# EAGLE design NS_ARM_Control_07_17_2017_10pm (EAGLE 6.6.0)
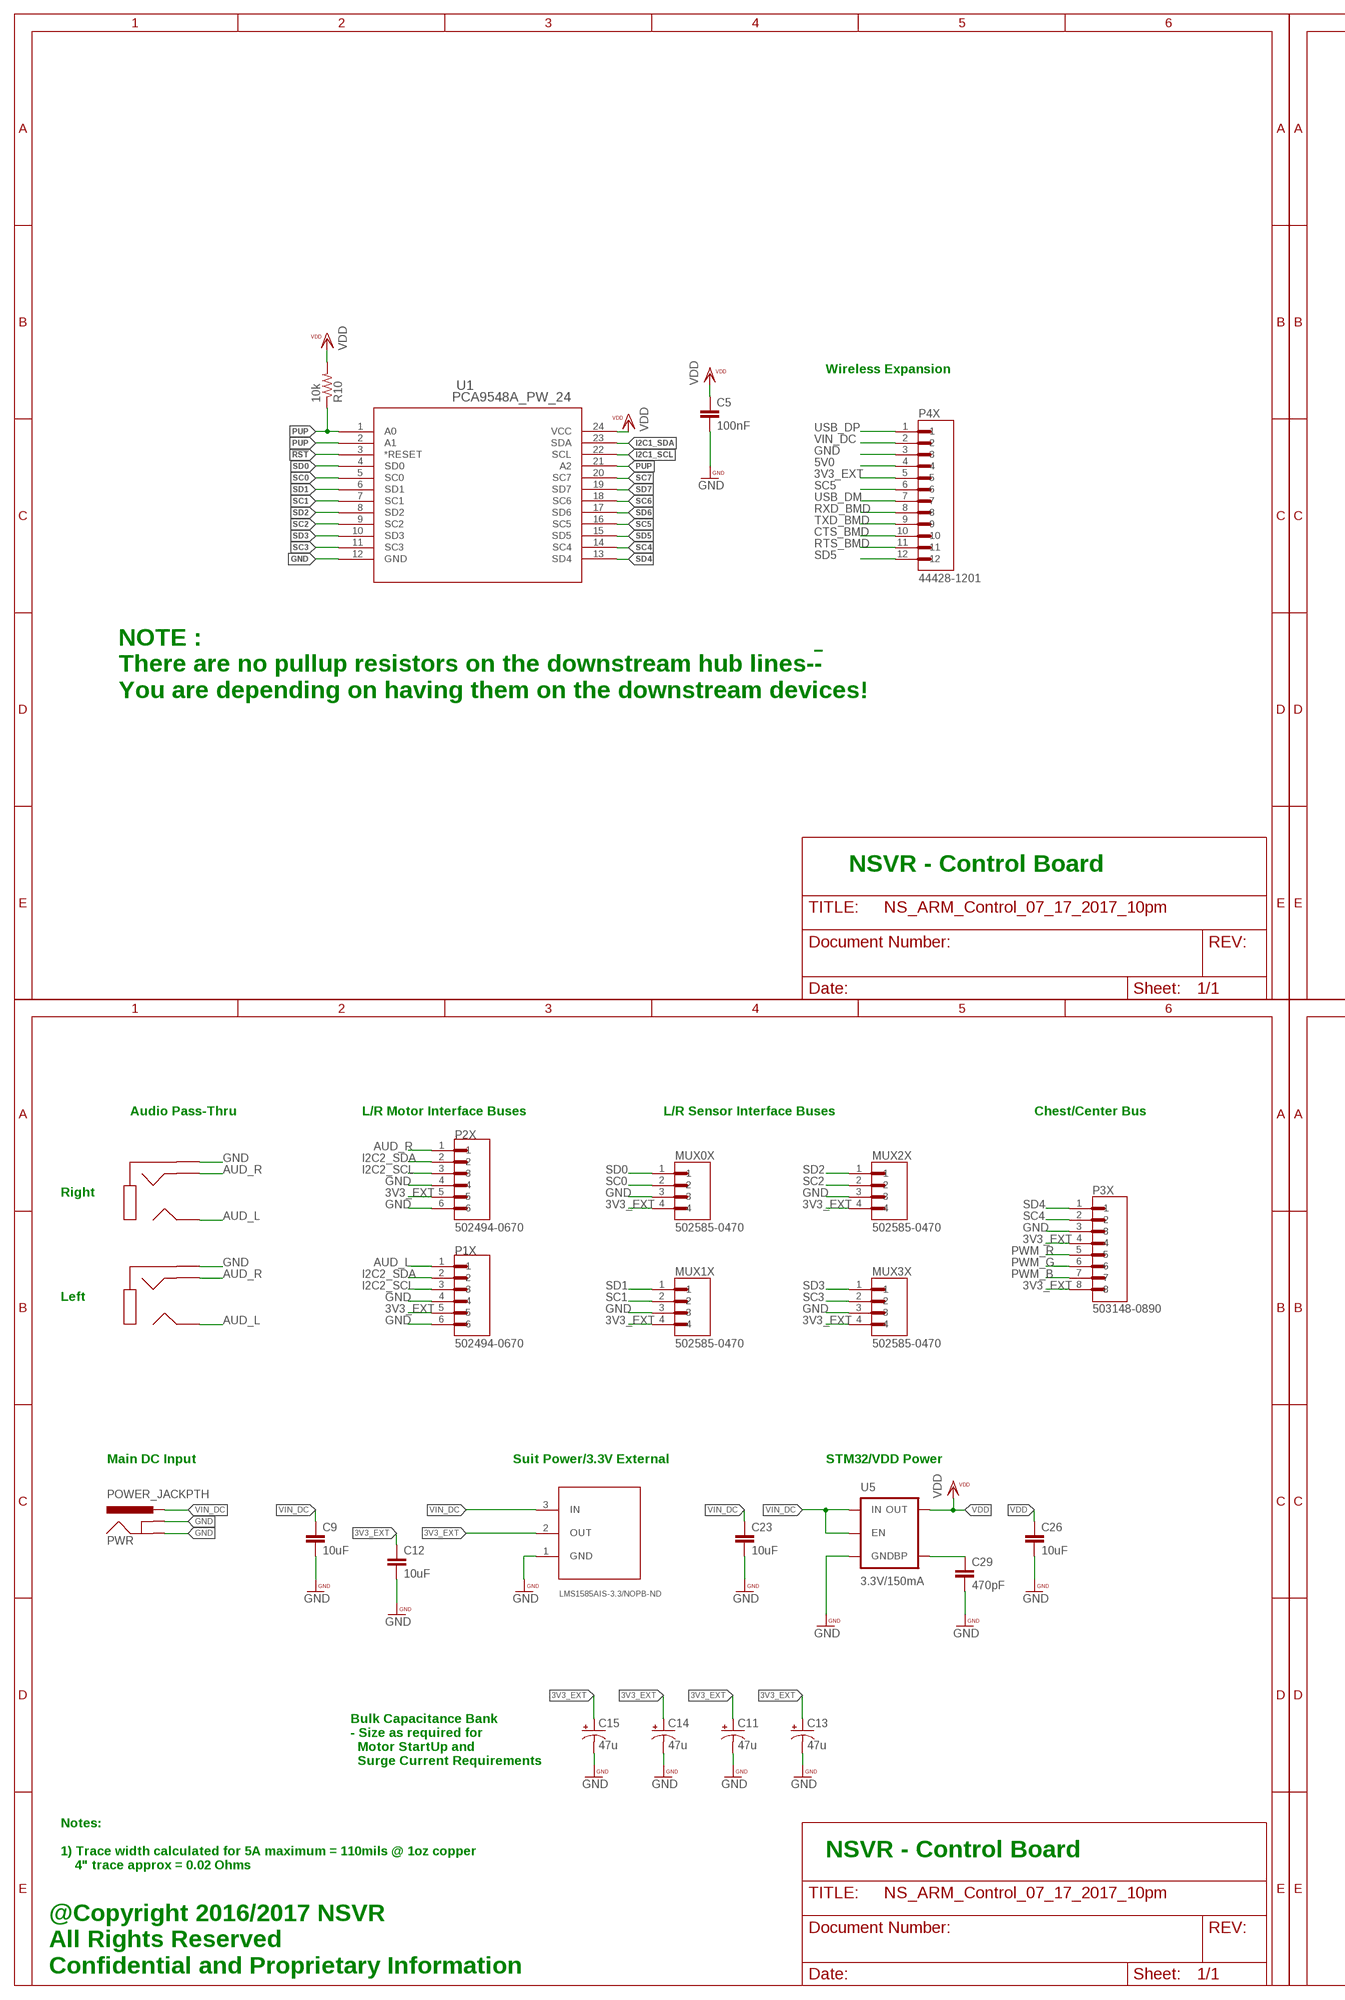
[diagram p0: schematic, sheet 1, part 1 of 2]
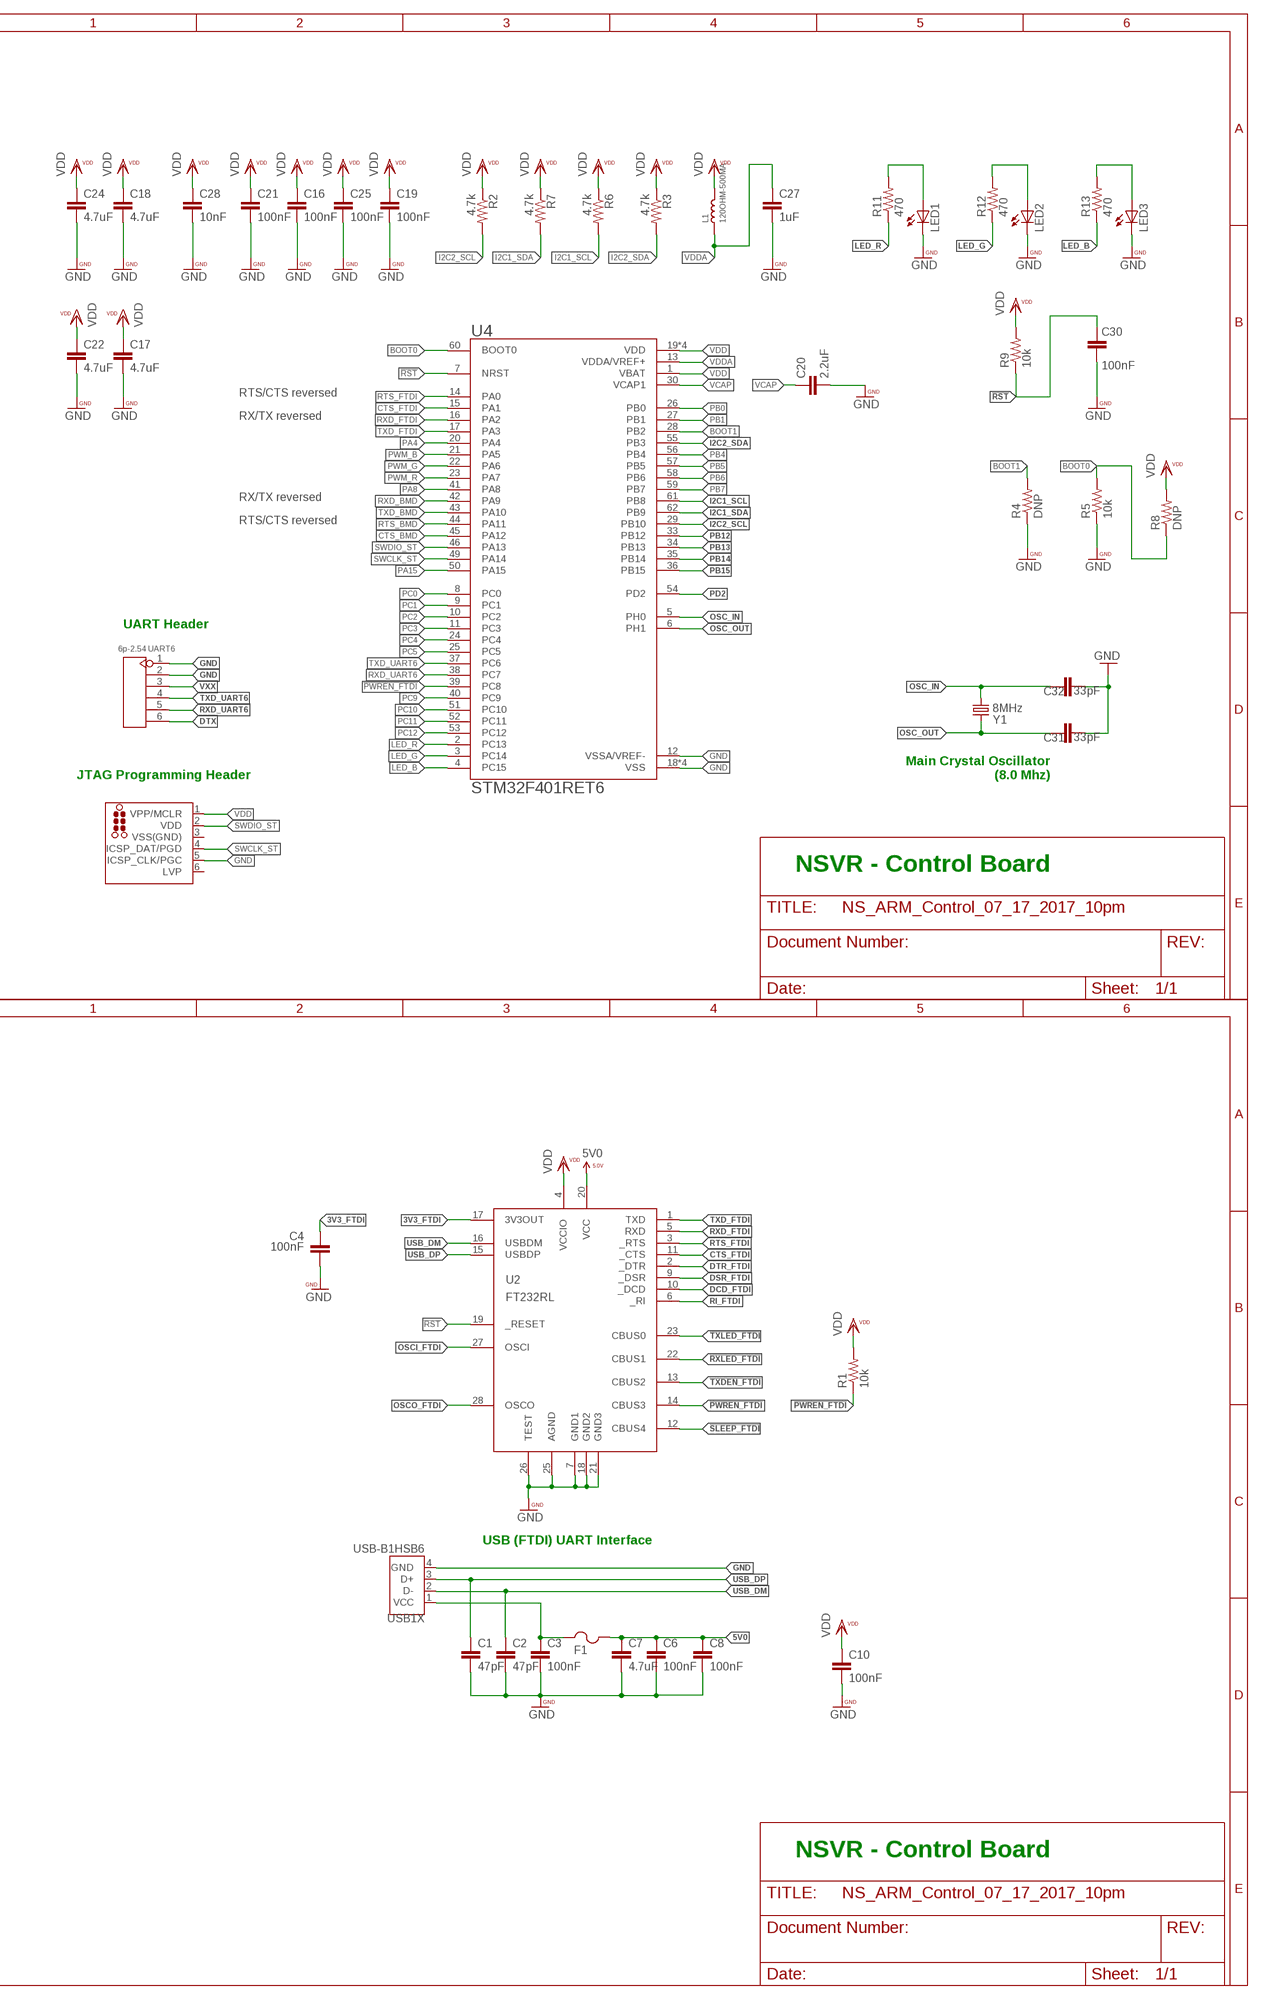
[diagram p1: schematic, sheet 1, part 2 of 2]

## Parts
C1  47pF  CAP0402-CAP  [0402-CAP]
C2  47pF  CAP0402-CAP  [0402-CAP]
C3  100nF  CAP0402-CAP  [0402-CAP]
C4  100nF  CAP0402-CAP  [0402-CAP]
C5  100nF  CAP0402-CAP  [0402-CAP]
C6  100nF  CAP0402-CAP  [0402-CAP]
C7  4.7uF  CAP0402-CAP  [0402-CAP]
C8  100nF  CAP0402-CAP  [0402-CAP]
C9  10uF  CAP0603-CAP  [0603-CAP]
C10  100nF  CAP0402-CAP  [0402-CAP]
C11  47u  CAP_POLD  [PANASONIC_D]
C12  10uF  CAP0603-CAP  [0603-CAP]
C13  47u  CAP_POLD  [PANASONIC_D]
C14  47u  CAP_POLD  [PANASONIC_D]
C15  47u  CAP_POLD  [PANASONIC_D]
C16  100nF  CAP0402-CAP  [0402-CAP]
C17  4.7uF  CAP0402-CAP  [0402-CAP]
C18  4.7uF  CAP0402-CAP  [0402-CAP]
C19  100nF  CAP0402-CAP  [0402-CAP]
C20  2.2uF  CAP0402-CAP  [0402-CAP]
C21  100nF  CAP0402-CAP  [0402-CAP]
C22  4.7uF  CAP0402-CAP  [0402-CAP]
C23  10uF  CAP0603-CAP  [0603-CAP]
C24  4.7uF  CAP0402-CAP  [0402-CAP]
C25  100nF  CAP0402-CAP  [0402-CAP]
C26  10uF  CAP0603-CAP  [0603-CAP]
C27  1uF  CAP0402-CAP  [0402-CAP]
C28  10nF  CAP0402-CAP  [0402-CAP]
C29  470pF  CAP0402-CAP  [0402-CAP]
C30  100nF  CAP0402-CAP  [0402-CAP]
C31  33pF  CAP0402-CAP  [0402-CAP]
C32  33pF  CAP0402-CAP  [0402-CAP]
F1  1206L050YR  [1206LSERIES]
J_ST  TC2030-MCP-NL  [TC2030-MCP-NL]
L1  120OHM-500MA  SMD-FERRITE-CHIP-120-OHM-500MA(0603)  [L0603]
LED1  LEDCHIP-LED0603  [CHIP-LED0603]
LED2  LEDCHIP-LED0603  [CHIP-LED0603]
LED3  LEDCHIP-LED0603  [CHIP-LED0603]
MUX0X  502585-0470  [MOLEX_502585-0470]
MUX1X  502585-0470  [MOLEX_502585-0470]
MUX2X  502585-0470  [MOLEX_502585-0470]
MUX3X  502585-0470  [MOLEX_502585-0470]
P1X  502494-0670  [MOLEX_502494-0670]
P2X  502494-0670  [MOLEX_502494-0670]
P3X  503148-0890  [MOLEX_503148-0890]
P4X  44428-1201  [MOLEX_44428-1201]
PJ1  SJ1-3513N  [SJ1-351XN]
PJ2  SJ1-3513N  [SJ1-351XN]
PWR  POWER_JACKPTH  [POWER_JACK_PTH]
R1  10k  RESISTOR0402-TYP  [EIA-0402]
R2  4.7k  RESISTOR0402-TYP  [EIA-0402]
R3  4.7k  RESISTOR0402-TYP  [EIA-0402]
R4  DNP  RESISTOR0402-TYP  [EIA-0402]
R5  10k  RESISTOR0402-TYP  [EIA-0402]
R6  4.7k  RESISTOR0402-TYP  [EIA-0402]
R7  4.7k  RESISTOR0402-TYP  [EIA-0402]
R8  DNP  RESISTOR0402-TYP  [EIA-0402]
R9  10k  RESISTOR0402-TYP  [EIA-0402]
R10  10k  RESISTOR0402-TYP  [EIA-0402]
R11  470  RESISTOR0402-TYP  [EIA-0402]
R12  470  RESISTOR0402-TYP  [EIA-0402]
R13  470  RESISTOR0402-TYP  [EIA-0402]
U1  PCA9548A_PW_24  [PW24]
U2  FT232RL  [SSOP28DB]
U3  LMS1585AIS-3.3/NOPB-ND  [TO254P1524X483-4N]
U4  STM32F401RET6  [QFP50P1200X1200X160-64N]
U5  3.3V/150mA  V_REG_MIC52053.3V  [SOT23-5]
UART6  6p-2.54  DIP-BLACK-FEMALE-HEADER-VERT(6P-2.54)  [H6-2.54]
USB1X  USB-B1HSB6  [OST_USB-B1HSB6]
Y1  8MHz  CRYSTAL5X3  [CRYSTAL-SMD-5X3]

## Nets
3V3_EXT: C11.+ C12.1 C13.+ C14.+ C15.+ MUX0X.4 MUX1X.4 MUX2X.4 MUX3X.4 P1X.5 P2X.5 P3X.4 P3X.8 P4X.5 U3.2(OUT)
3V3_FTDI: C4.1 U2.17(3V3OUT)
5V0: C6.1 C7.1 C8.1 F1.2 P4X.4 U2.20(VCC)
!PWREN_FTDI: R1.1 U2.14(CBUS3) U4.39(PC8)
!RST: C30.1 R9.1 U1.3(*RESET) U2.19(_RESET) U4.7(NRST)
!RXLED_FTDI: U2.22(CBUS1)
!SLEEP_FTDI: U2.12(CBUS4)
!TXDEN_FTDI: U2.13(CBUS2)
!TXLED_FTDI: U2.23(CBUS0)
AUD_L: P1X.1 PJ1.2 PJ2.2
AUD_R: P2X.1 PJ1.3 PJ2.3
BOOT0: R5.2 R8.1 U4.60(BOOT0)
BOOT1: R4.2 U4.28(PB2)
CTS_BMD: P4X.10 U4.45(PA12)
CTS_FTDI: U2.11(_CTS) U4.15(PA1)
DCD_FTDI: U2.10(_DCD)
DSR_FTDI: U2.9(_DSR)
DTR_FTDI: U2.2(_DTR)
DTX: UART6.6
GND: C1.2 C2.2 C3.2 C4.2 C5.2 C6.2 C7.2 C8.2 C9.2 C10.2 C11.- C12.2 C13.- C14.- C15.- C16.2 C17.2 C18.2 C19.2 C20.2 C21.2 C22.2 C23.2 C24.2 C25.2 C26.2 C27.2 C28.2 C29.2 C30.2 C31.1 C32.1 J_ST.5(ICSP_CLK/PGC) LED1.C LED2.C LED3.C MUX0X.3 MUX1X.3 MUX2X.3 MUX3X.3 P1X.4 P1X.6 P2X.4 P2X.6 P3X.3 P4X.3 PJ1.1 PJ2.1 PWR.GND PWR.GNDBREAK R4.1 R5.1 U1.12(GND) U2.7(GND1) U2.18(GND2) U2.21(GND3) U2.25(AGND) U2.26(TEST) U3.1(GND) U4.12(VSSA/VREF-) U4.18(VSS) U4.31(VSS) U4.47(VSS) U4.63(VSS) U5.2(GND) UART6.1 UART6.2 USB1X.4(GND)
I2C1_SCL: R6.2 U1.22(SCL) U4.61(PB8)
I2C1_SDA: R7.2 U1.23(SDA) U4.62(PB9)
I2C2_SCL: P1X.3 P2X.3 R2.2 U4.29(PB10)
I2C2_SDA: P1X.2 P2X.2 R3.2 U4.55(PB3)
LED1: LED1.A R11.2
LED2: LED2.A R12.2
LED3: LED3.A R13.2
LED_B: R13.1 U4.4(PC15)
LED_G: R12.1 U4.3(PC14)
LED_R: R11.1 U4.2(PC13)
N$7: C29.1 U5.4(BP)
OSC_IN: C32.2 U4.5(PH0) Y1.1
OSC_OUT: C31.2 U4.6(PH1) Y1.3
OSCI_FTDI: U2.27(OSCI)
OSCO_FTDI: U2.28(OSCO)
PA4: U4.20(PA4)
PA8: U4.41(PA8)
PA15: U4.50(PA15)
PB0: U4.26(PB0)
PB1: U4.27(PB1)
PB4: U4.56(PB4)
PB5: U4.57(PB5)
PB6: U4.58(PB6)
PB7: U4.59(PB7)
PB12: U4.33(PB12)
PB13: U4.34(PB13)
PB14: U4.35(PB14)
PB15: U4.36(PB15)
PC0: U4.8(PC0)
PC1: U4.9(PC1)
PC2: U4.10(PC2)
PC3: U4.11(PC3)
PC4: U4.24(PC4)
PC5: U4.25(PC5)
PC9: U4.40(PC9)
PC10: U4.51(PC10)
PC11: U4.52(PC11)
PC12: U4.53(PC12)
PD2: U4.54(PD2)
PUP: R10.1 U1.1(A0) U1.2(A1) U1.21(A2)
PWM_B: P3X.7 U4.21(PA5)
PWM_G: P3X.6 U4.22(PA6)
PWM_R: P3X.5 U4.23(PA7)
RI_FTDI: U2.6(_RI)
RTS_BMD: P4X.11 U4.44(PA11)
RTS_FTDI: U2.3(_RTS) U4.14(PA0)
RXD_BMD: P4X.8 U4.42(PA9)
RXD_FTDI: U2.5(RXD) U4.16(PA2)
RXD_UART6: U4.38(PC7) UART6.5
SC0: MUX0X.2 U1.5(SC0)
SC1: MUX1X.2 U1.7(SC1)
SC2: MUX2X.2 U1.9(SC2)
SC3: MUX3X.2 U1.11(SC3)
SC4: P3X.2 U1.14(SC4)
SC5: P4X.6 U1.16(SC5)
SC6: U1.18(SC6)
SC7: U1.20(SC7)
SD0: MUX0X.1 U1.4(SD0)
SD1: MUX1X.1 U1.6(SD1)
SD2: MUX2X.1 U1.8(SD2)
SD3: MUX3X.1 U1.10(SD3)
SD4: P3X.1 U1.13(SD4)
SD5: P4X.12 U1.15(SD5)
SD6: U1.17(SD6)
SD7: U1.19(SD7)
SWCLK_ST: J_ST.4(ICSP_DAT/PGD) U4.49(PA14)
SWDIO_ST: J_ST.2(VDD) U4.46(PA13)
TXD_BMD: P4X.9 U4.43(PA10)
TXD_FTDI: U2.1(TXD) U4.17(PA3)
TXD_UART6: U4.37(PC6) UART6.4
USB_DM: C2.1 P4X.7 U2.16(USBDM) USB1X.2(D-)
USB_DP: C1.1 P4X.1 U2.15(USBDP) USB1X.3(D+)
VBUS_IN: C3.1 F1.1 USB1X.1(VCC)
VCAP: C20.1 U4.30(VCAP1)
VDD: C5.1 C10.1 C16.1 C17.1 C18.1 C19.1 C21.1 C22.1 C24.1 C25.1 C26.1 C28.1 J_ST.1(VPP/MCLR) L1.2 R1.2 R2.1 R3.1 R6.1 R7.1 R8.2 R9.2 R10.2 U1.24(VCC) U2.4(VCCIO) U4.1(VBAT) U4.19(VDD) U4.32(VDD) U4.48(VDD) U4.64(VDD) U5.5(OUT)
VDDA: C27.1 L1.1 U4.13(VDDA/VREF+)
VIN_DC: C9.1 C23.1 P4X.2 PWR.PWR U3.3(IN) U5.1(IN) U5.3(EN)
VXX: UART6.3
Unconnected: J_ST.6(LVP)

## Notes on the sheet
- Wireless Expansion
- RTS/CTS reversed
- RX/TX reversed
- RX/TX reversed
- RTS/CTS reversed
- UART Header
- NOTE :
  There are no pullup resistors on the downstream hub lines-!-
  You are depending on having them on the downstream devices!
- Main Crystal Oscillator
      (8.0 Mhz)
- JTAG Programming Header
- NSVR - Control Board | NSVR - Control Board
- Audio Pass-Thru | L/R Motor Interface Buses | L/R Sensor Interface Buses | Chest/Center Bus
- Right
- Left
- Main DC Input | Suit Power/3.3V External | STM32/VDD Power
- USB (FTDI) UART Interface
- Bulk Capacitance Bank
  - Size as required for
    Motor StartUp and
    Surge Current Requirements
- NSVR - Control Board | NSVR - Control Board
- Notes:
  
  1) Trace width calculated for 5A maximum = 110mils @ 1oz copper
      4" trace approx = 0.02 Ohms
- @Copyright 2016/2017 NSVR
  All Rights Reserved
  Confidential and Proprietary Information

## Power pins joined to a net without a drawn wire
VSS(GND): J_ST.3(VSS(GND))

## Library data of the parts
C1-C10 C12 C16-C32 = PatternAgents-ProtoPads:CAP: Capacitor Standard 0603 ceramic capacitor, and 0.1" leaded capacitor.
C11 C13-C15 = SparkFun-Capacitors:CAP_POL: Capacitor Polarized These are standard SMD and PTH capacitors. Normally 10uF, 47uF, and 100uF in electrolytic and tantalum varieties. Always verify the external diameter of the through hole cap, it varies with capacity, voltage, and manufacturer. The EIA devices should be standard.
F1 = 1206L050:1206L050YR; COPYRIGHT: Copyright C 2015 Accelerated Designs. All rights reserved; MANUFACTURER_PART_NUMBER: 1206L050YR; VENDOR: Littelfuse Inc
J_ST = tag-connect:TC2030: TAG-CONNECT ICSP Connector Manufacturer: Tag-Connect <http://www.tag-connect.com> Cable for easy In-Circuit Serial Programming. Designed for Microchip ICD2, suitable for many others. Two variants - one "with legs" (for hands-free fit on PCB) and another "without legs" for quick programming. PAD Description 1 MCLR/Vpp 2 Vdd 3 GND 4 PGD (ISPDAT) 5 PGC (ISPCLK) 6 nc (used for LVP) ©2009 ROFA.cz - modified and updated by Robert Darlington ‹rdarlington@gmail.com›
L1 = Seeed-Inductor-2016:SMD-FERRITE-CHIP-120-OHM-500MA(0603): 303030001; MPN: BLM18AG121SN1D
LED1-LED3 = led:LED: LED OSRAM: - CHIPLED LG R971, LG N971, LY N971, LG Q971, LY Q971, LO R971, LY R971 LH N974, LH R974 LS Q976, LO Q976, LY Q976 LO Q996 - Hyper CHIPLED LW Q18S LB Q993, LB Q99A, LB R99A - SideLED LS A670, LO A670, LY A670, LG A670, LP A670 LB A673, LV A673, LT A673, LW A673 LH A674 LY A675 LS A676, LA A676, LO A676, LY A676, LW A676 LS A679, LY A679, LG A679 - Hyper Micro SIDELED® LS Y876, LA Y876, LO Y876, LY Y876 LT Y87S - SmartLED LW L88C, LW L88S LB L89C, LB L89S, LG L890 LS L89K, LO L89K, LY L89K LS L896, LA L896, LO L896, LY L896 - TOPLED LS T670, LO T670, LY T670, LG T670, LP T670 LSG T670, LSP T670, LSY T670, LOP T670, LYG T670 LG T671, LOG T671, LSG T671 LB T673, LV T673, LT T673, LW T673 LH T674 LS T676, LA T676, LO T676, LY T676, LB T676, LH T676, LSB T676, LW T676 LB T67C, LV T67C, LT T67C, LS T67K, LO T67K, LY T67K, LW E67C LS E67B, LA E67B, LO E67B, LY E67B, LB E67C, LV E67C, LT E67C LW T67C LS T679, LY T679, LG T679 LS T770, LO T770, LY T770, LG T770, LP T770 LB T773, LV T773, LT T773, LW T773 LH T774 LS E675, LA E675, LY E675, LS T675 LS T776, LA T776, LO T776, LY T776, LB T776 LHGB T686 LT T68C, LB T68C - Hyper Mini TOPLED® LB M676 - Mini TOPLED Santana® LG M470 LS M47K, LO M47K, LY M47K Source: http://www.osram.convergy.de LUXEON: - LUMILED® LXK2-PW12-R00, LXK2-PW12-S00, LXK2-PW14-U00, LXK2-PW14-V00 LXK2-PM12-R00, LXK2-PM12-S00, LXK2-PM14-U00 LXK2-PE12-Q00, LXK2-PE12-R00, LXK2-PE12-S00, LXK2-PE14-T00, LXK2-PE14-U00 LXK2-PB12-K00, LXK2-PB12-L00, LXK2-PB12-M00, LXK2-PB14-N00, LXK2-PB14-P00, LXK2-PB14-Q00 LXK2-PR12-L00, LXK2-PR12-M00, LXK2-PR14-Q00, LXK2-PR14-R00 LXK2-PD12-Q00, LXK2-PD12-R00, LXK2-PD12-S00 LXK2-PH12-R00, LXK2-PH12-S00 LXK2-PL12-P00, LXK2-PL12-Q00, LXK2-PL12-R00 Source: www.luxeon.com KINGBRIGHT: KA-3528ASYC Source: www.kingbright.com
MUX0X MUX1X MUX2X MUX3X = 502585-0470:502585-0470: 1.50mm Pitch CLIK-Mate™ Wire-to-Board PCB Receptacle, Single Row, Right Angle, 4 Circuits; AVAILABILITY: Good; DESCRIPTION: 1.50mm Pitch CLIK-Mate™ Wire-to-Board PCB Receptacle, Single Row, Right Angle, 4 Circuits; MF: Molex; MP: 502585-0470; PACKAGE: None; PRICE: 0.44 USD
P1X P2X = 502494-0670:502494-0670: 2.00mm Pitch CLIK-Mate™ Wire-to-Board PCB Receptacle, Single Row, Right Angle, 6 Circuits; AVAILABILITY: Good; DESCRIPTION: 2.00mm Pitch CLIK-Mate™ Wire-to-Board PCB Receptacle, Single Row, Right Angle, 6 Circuits; MF: Molex; MP: 502494-0670; PACKAGE: None; PRICE: 0.53 USD
P3X = 503148-0890:503148-0890: 1.5wb Dual r/a Embs Tape Pkg 8p; AVAILABILITY: Good; DESCRIPTION: 1.5wb Dual r/a Embs Tape Pkg 8p; MF: Molex; MP: 503148-0890; PACKAGE: None; PRICE: 1.11 USD
P4X = 44428-1201:44428-1201: Conn Wire to Board HDR 12 POS 3mm Solder RA Thru-Hole Micro-Fit 3.0 BMI? Tray; AVAILABILITY: Good; DESCRIPTION: Conn Wire to Board HDR 12 POS 3mm Solder RA Thru-Hole Micro-Fit 3.0 BMI? Tray; MF: Molex; MP: 44428-1201; PACKAGE: None; PRICE: 2.39 USD
PJ1 PJ2 = audio_mux:SJ1-3513N
PWR = SparkFun-Connectors:POWER_JACK: Power Jack This is the standard 5.5mm barrel jack for power. The PTH is the most common, proven, reliable, footprint. The Slot footprint only works if the mill layer is transmitted to the PCB fab house so be warned. Mating wall wart : TOL-00298 (and others); PROD_ID: CONN-08197
R1-R13 = PatternAgents-ProtoPads:RESISTOR: Resistor Basic schematic elements and footprints for 0603, 1206, and PTH resistors.
U1 = PCA9548A_PW_124:PCA9548A_PW_24; DATASHEETURL: http://www.ti.com/lit/gpn/PCA9548A; DESCRIPTION: 8-Channel I2C Switch With Reset; FAMILY_NAME: I2C MULTIPLEXER, SWITCH; GENERIC_PART_NUMBER: PCA9548A; INDUSTRY_STD_PKG_TYPE: TSSOP; MANUFACTURER: Texas Instruments; MANUFACTURER_PART_NUMBER: pca9548a_pw_24; PACKAGE_DESIGNATOR: PW; PIN_COUNT: 24; VENDOR: Texas Instruments
U2 = ftdichip-3:FT232RL: USB UART 4th Generation USB UART (USB <-> Serial) Controller
U3 = TO254P1524X483-4N:LMS1585AIS-3.3/NOPB-ND
U4 = STM32F401RET6:STM32F401RET6: MCU 32-Bit STM32 ARM Cortex M4 RISC 512KB Flash 1.8V/2.5V/3.3V 64-Pin LQFP Tray; AVAILABILITY: Good; DESCRIPTION: MCU 32-Bit STM32 ARM Cortex M4 RISC 512KB Flash 1.8V/2.5V/3.3V 64-Pin LQFP Tray; MF: STMicroelectronics; MP: STM32F401RET6; PACKAGE: LQFP-64 STMicroelectronics; PRICE: 4.74 USD
U5 = SparkFun-PowerIC:V_REG_MIC5205: V_REG MIC5205 Standard 3.3V, 5V, and Adjustable 150mA LDO voltage regulator in SOT-23 layout. Micrel part MIC5205. BP (by-pass) pin is used to lower output noise with 470pF cap, may be left open. On the adjustable version BP is used to set output.; PROD_ID: VREG-00822
UART6 = Seeed-Connector -2016:DIP-BLACK-FEMALE-HEADER-VERT(6P-2.54): 320030060; MPN: F185-1106A1BSYC1
USB1X = USB-B1HSB6:USB-B1HSB6: Conn Usb Type b r/a Black; AVAILABILITY: Warning; DESCRIPTION: Conn Usb Type b r/a Black; MF: On Shore Technology; MP: USB-B1HSB6; PACKAGE: None; PRICE: 0.42 USD
Y1 = SparkFun2:CRYSTAL: Crystals Various standard crystals. Proven footprints. Spark Fun Electronics SKU : COM-00534

## Net classes
1 vcc: width 0.254 mm

## Board
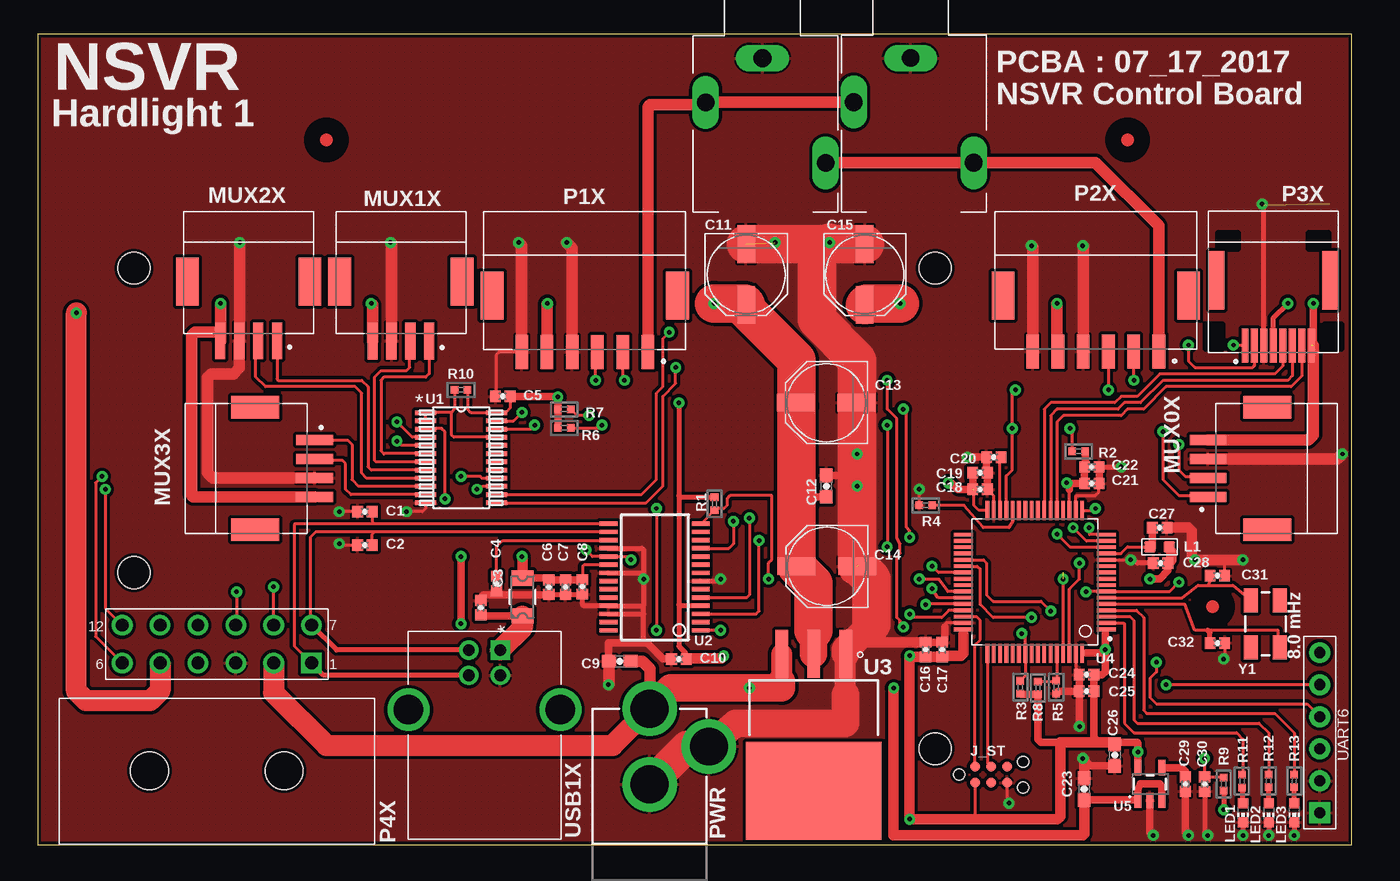
[diagram p2: board, top side]
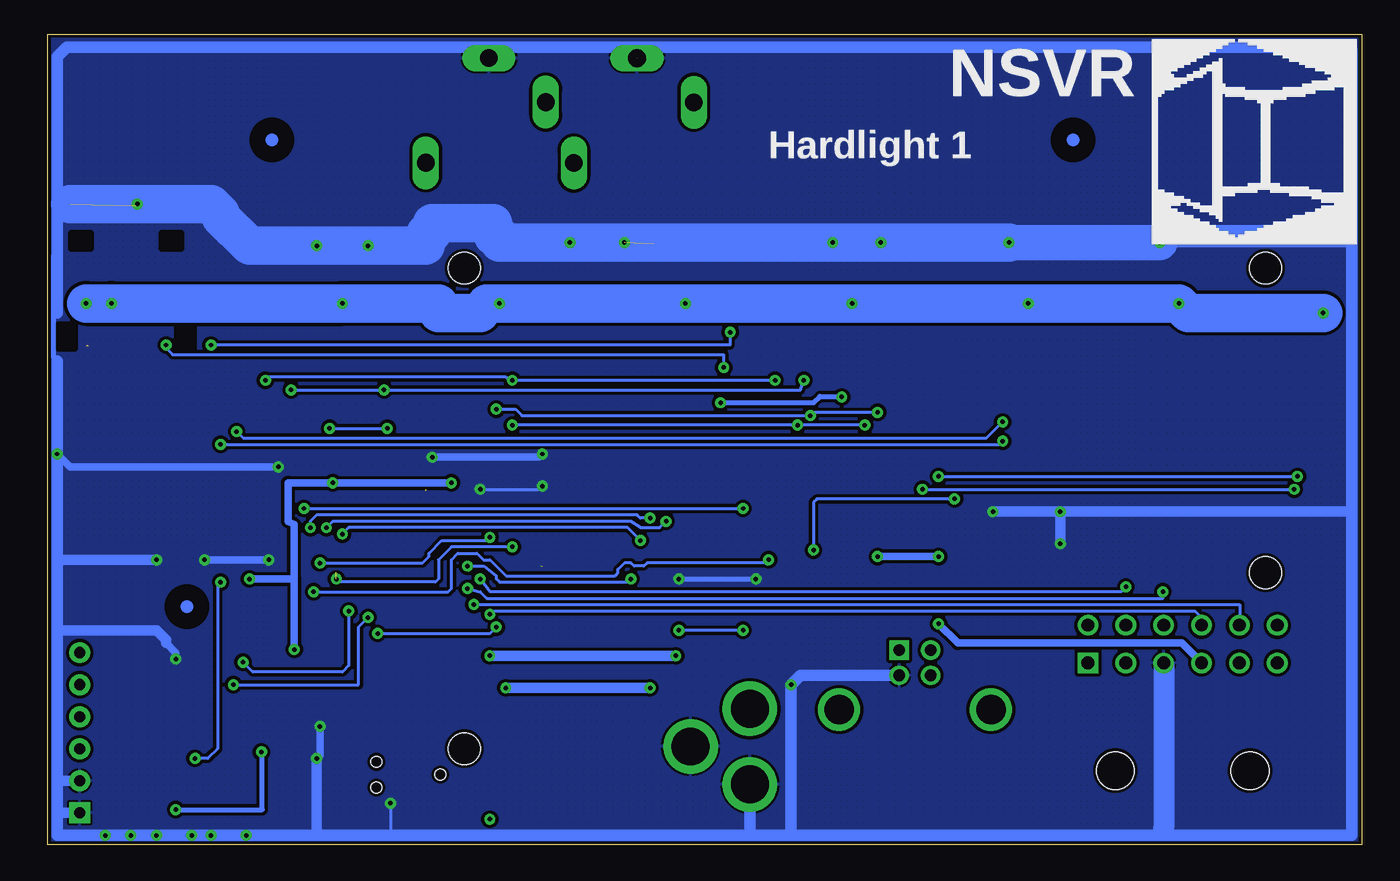
[diagram p3: board, bottom side, seen from below]

Size 104.14 x 64.26 mm. Coordinates in mm from the lower left corner, seen from the top.
Outline: 104.14,0 104.14,64.26 0,64.26 0,0 104.14,0
Copper layers (1*16): Top 0.035mm / dielectric 1.5mm / Bottom 0.035mm
Design rules "PatternAgents_7mil": minimum track width 7mil, minimum drill 14mil, track to track 7mil, track to pad 7mil, pad to pad 7mil, via to via 7mil, smd to smd 7mil, copper to edge 7mil, drill to drill 7mil, minimum pad ring 12mil, minimum via ring 10mil, stop-mask expansion 4mil, vias tented up to drill 25mil, thermal gap 7mil
Holes 2.54 mm at 71.12,45.72 7.62,45.72 71.12,7.62 7.62,21.59

### Footprints (pad centres in the part's own frame; a part is rotated, then mirrored left to right if it is on the bottom)
0402-CAP = smd 0.85 x 0.9: 1 -0.58,0; 2 0.58,0
0603-CAP = smd 1.1 x 1: 1 -0.85,0; 2 0.85,0
PANASONIC_D = smd 3 x 1.4: + 2.4,0; - -2.4,0
1206LSERIES = smd 1.219 x 1.778: 1 -1.499,0; 2 1.499,0
TC2030-MCP-NL = smd 0.787 x 0.787: 1 1.27,-0.635; 2 1.27,0.635; 3 2.54,-0.635; 4 2.54,0.635; 5 3.81,-0.635; 6 3.81,0.635 | hole 0.889: 0,0; 5.08,-1.016; 5.08,1.016
L0603 = smd 0.889 x 0.889: 1 -0.762,0; 2 0.762,0
CHIP-LED0603 = smd 0.8 x 0.8: A 0,-0.75; C 0,0.75
MOLEX_502585-0470 = smd 0.8 x 2.9: 1 -2.25,0; 2 -0.75,0; 3 0.75,0; 4 2.25,0 | smd 1.8 x 3.8: P1 -4.85,-4.7; P2 4.85,-4.7
MOLEX_502494-0670 = smd 1 x 2.7: 1 -5,0; 2 -3,0; 3 -1,0; 4 1,0; 5 3,0; 6 5,0 | smd 1.8 x 3.8: P1 -7.35,-4.45; P2 7.35,-4.45
MOLEX_503148-0890 = smd 0.55 x 2.7: 1 2.25,0; 2 1.5,0; 3 0.75,0; 4 0,0; 5 -0.75,0; 6 -1.5,0; 7 -2.25,0; 8 -3,0 | smd 1.2 x 4.65: P1 -4.48,-5.175; P2 4.48,-5.175
MOLEX_44428-1201 = drill 1.02 square: 1 7.5,5.065 | drill 1.02: 2 4.5,5.065; 3 1.5,5.065; 4 -1.5,5.065; 5 -4.5,5.065; 6 -7.5,5.065; 7 7.5,8.065; 8 4.5,8.065; 9 1.5,8.065; 10 -1.5,8.065; 11 -4.5,8.065; 12 -7.5,8.065 | hole 3: -5.34,-3.465; 5.34,-3.465
SJ1-351XN = drill 1.4 long: 1 0.8,0; 2 4.3,-4.5; 3 9.1,5
POWER_JACK_PTH = drill 2.997 pad 4.318: GND 0,7.7; GNDBREAK 4.7,10.7; PWR 0,13.7
EIA-0402 = smd 0.6 x 0.6: 1 -0.508,0; 2 0.508,0
PW24 = smd 1.676 x 0.356: 1 -2.819,3.575; 2 -2.819,2.925; 3 -2.819,2.275; 4 -2.819,1.625; 5 -2.819,0.975; 6 -2.819,0.325; 7 -2.819,-0.325; 8 -2.819,-0.975; 9 -2.819,-1.625; 10 -2.819,-2.275; 11 -2.819,-2.925; 12 -2.819,-3.575; 13 2.819,-3.575; 14 2.819,-2.925; 15 2.819,-2.275; 16 2.819,-1.625; 17 2.819,-0.975; 18 2.819,-0.325; 19 2.819,0.325; 20 2.819,0.975; 21 2.819,1.625; 22 2.819,2.275; 23 2.819,2.925; 24 2.819,3.575
SSOP28DB = smd 0.348 x 1.397: 1 -4.225,-3.656; 2 -3.575,-3.656; 3 -2.925,-3.656; 4 -2.275,-3.656; 5 -1.625,-3.656; 6 -0.975,-3.656; 7 -0.325,-3.656; 8 0.325,-3.656; 9 0.975,-3.656; 10 1.625,-3.656; 11 2.275,-3.656; 12 2.925,-3.656; 13 3.575,-3.656; 14 4.225,-3.656; 15 4.225,3.656; 16 3.575,3.656; 17 2.925,3.656; 18 2.275,3.656; 19 1.625,3.656; 20 0.975,3.656; 21 0.325,3.656; 22 -0.325,3.656; 23 -0.975,3.656; 24 -1.625,3.656; 25 -2.275,3.656; 26 -2.925,3.656; 27 -3.575,3.656; 28 -4.225,3.656
TO254P1524X483-4N = smd 3.8 x 1: 1 -6.4,2.54; 2 -6.4,0; 3 -6.4,-2.54 | smd 7.75 x 10.75: TAB 4.45,0
QFP50P1200X1200X160-64N = smd 1.5 x 0.3: 1 -5.67,3.75; 2 -5.67,3.25; 3 -5.67,2.75; 4 -5.67,2.25; 5 -5.67,1.75; 6 -5.67,1.25; 7 -5.67,0.75; 8 -5.67,0.25; 9 -5.67,-0.25; 10 -5.67,-0.75; 11 -5.67,-1.25; 12 -5.67,-1.75; 13 -5.67,-2.25; 14 -5.67,-2.75; 15 -5.67,-3.25; 16 -5.67,-3.75; 33 5.67,-3.75; 34 5.67,-3.25; 35 5.67,-2.75; 36 5.67,-2.25; 37 5.67,-1.75; 38 5.67,-1.25; 39 5.67,-0.75; 40 5.67,-0.25; 41 5.67,0.25; 42 5.67,0.75; 43 5.67,1.25; 44 5.67,1.75; 45 5.67,2.25; 46 5.67,2.75; 47 5.67,3.25; 48 5.67,3.75 | smd 0.3 x 1.5: 17 -3.75,-5.67; 18 -3.25,-5.67; 19 -2.75,-5.67; 20 -2.25,-5.67; 21 -1.75,-5.67; 22 -1.25,-5.67; 23 -0.75,-5.67; 24 -0.25,-5.67; 25 0.25,-5.67; 26 0.75,-5.67; 27 1.25,-5.67; 28 1.75,-5.67; 29 2.25,-5.67; 30 2.75,-5.67; 31 3.25,-5.67; 32 3.75,-5.67; 49 3.75,5.67; 50 3.25,5.67; 51 2.75,5.67; 52 2.25,5.67; 53 1.75,5.67; 54 1.25,5.67; 55 0.75,5.67; 56 0.25,5.67; 57 -0.25,5.67; 58 -0.75,5.67; 59 -1.25,5.67; 60 -1.75,5.67; 61 -2.25,5.67; 62 -2.75,5.67; 63 -3.25,5.67; 64 -3.75,5.67
SOT23-5 = smd 0.55 x 1.2: 1 -0.95,-1.3; 2 0,-1.3; 3 0.95,-1.3; 4 0.95,1.3; 5 -0.95,1.3
H6-2.54 = drill 0.889 pad 1.651 square: 1 0,6.35 | drill 0.889 pad 1.651: 2 0,3.81; 3 0,1.27; 4 0,-1.27; 5 0,-3.81; 6 0,-6.35
OST_USB-B1HSB6 = drill 0.92 square: 1 1.25,4.71 | drill 0.92: 2 -1.25,4.71; 3 -1.25,2.71; 4 1.25,2.71 | drill 2.33: P1 -6.02,0; P2 6.02,0
CRYSTAL-SMD-5X3 = smd 1.9 x 1.1: 1 -1.85,-1.15; 2 1.85,-1.15; 3 1.85,1.15; 4 -1.85,1.15

### Placement (x,y rotation side)
C1  25.91,26.42 180 top
C2  25.91,23.75 180 top
C3  35.09,18.81 90 top
C4  36.35,20.72 270 top
C5  36.83,35.56 180 top
C6  40.49,20.43 270 top
C7  41.82,20.43 270 top
C8  43.15,20.45 270 top
C9  46.12,14.55 180 top
C10  50.8,14.73 180 top
C11  56.13,45.21 270 top
C12  62.48,28.45 90 top
C13  62.48,35.05 180 top
C14  62.53,22.09 180 top
C15  65.53,45.21 270 top
C16  70.36,15.49 90 top
C17  71.67,15.49 90 top
C18  74.67,28.18 0 top
C19  74.67,29.5 0 top
C20  75.76,30.73 180 top
C21  83.53,28.65 0 top
C22  83.53,29.95 0 top
C23  82.92,4.44 90 top
C24  83.1,13.5 180 top
C25  83.1,12.19 180 top
C26  85.34,7.11 270 top
C27  88.9,25.15 0 top
C28  88.98,22.33 180 top
C29  90.93,4.83 270 top
C30  92.47,4.81 270 top
C31  93.47,21.34 180 top
C32  93.47,16 180 top
F1  38.41,19.65 90 top
J_ST  73,5.57 0 top
L1  88.9,23.62 0 top
LED1  95.51,2.55 180 top
LED2  97.54,2.54 180 top
LED3  99.57,2.54 180 top
MUX0X  92.73,29.84 90 top
MUX1X  28.76,39.94 180 top
MUX2X  16.7,39.95 180 top
MUX3X  21.93,29.84 270 top
P1X  43.34,39.09 180 top
P2X  83.84,39.1 180 top
P3X  97.92,39.58 180 top
P4X  14.18,9.35 0 top
PJ1  57.42,63.16 270 top
PJ2  69.16,63.18 270 top
PWR  48.47,-2.9 0 top
R1  53.62,27.04 90 top
R2  82.49,31.2 180 top
R3  77.85,12.5 90 top
R4  70.36,26.92 0 top
R5  80.7,12.5 90 top
R6  41.71,33.05 0 top
R7  41.72,34.53 0 top
R8  79.25,12.45 270 top
R9  93.98,4.83 270 top
R10  33.53,36.07 0 top
R11  95.43,5.06 270 top
R12  97.54,5.08 270 top
R13  99.57,5.08 270 top
U1  33.54,30.69 0 top
U2  48.87,21.23 90 top
U3  61.48,8.74 270 top
U4  79,20.84 180 top
U5  88.14,4.83 0 top
U$1  [CIRCLE-1MM-3R]  22.86,55.88 0 top
U$2  [CIRCLE-1MM-3R]  86.36,55.88 0 top
U$3  [CIRCLE-1MM-3R]  93.09,18.89 0 top
U$100  [NSVR_LOGO]  16.51,47.75 0 bottom
UART6  101.6,8.89 180 top
USB1X  35.39,10.73 0 top
Y1  97.28,17.53 90 top

### Tracks (layer width: path | path; a pad name or v marks a point on that pad's centre or on a via)
3V3_EXT  (via drill 0.36)  (1 unrouted)
  Top 0.406: MUX2X.4 14.48,39.95 | P3X.4 97.92,41.78 v99.06,42.93 | 60.29,27.6 60.13,26.92
  Top 0.61: 101.09,39.58 v101.09,42.93 | C12.1 60.29,27.6
  Top 0.914: 14.48,39.95 14.48,40.64 | 14.48,40.64 v14.48,42.93 | v80.77,42.93 80.77,39.16 P2X.5 | P1X.5 40.34,42.88 v40.39,42.93 | MUX1X.4 26.51,42.83 v26.42,42.93 | MUX3X.4 12.28,27.59 12.19,27.69 12.19,40.39 12.45,40.64 14.48,40.64 | MUX0X.4 100.67,32.09 101.09,32.51 101.09,39.58
  Top 1.422: C13.+ 60.08,34.84 60.13,34.8
  Top 1.676: P4X.5 9.68,12.22 8.89,11.43 3.81,11.43 3.05,12.19 v3.05,42.16
  Top 2.184: U3.2 61.48,17.01 61.47,17.02
  Top 3.048: v68.33,42.93 65.65,42.93 C15.+ | v53.59,42.93 55.63,42.93 | 55.63,42.93 56.02,42.93 C11.+ | 55.63,42.93 60.13,38.42 60.13,34.8 60.13,26.92 C14.+ 61.47,20.75 61.47,17.02
  Bottom 0.406: v99.06,42.93 99.06,43.94 99.31,44.2
  Bottom 3.048: v101.09,42.93 v99.06,42.93 v80.77,42.93 73.15,42.93 73.15,42.16 69.85,42.16 69.34,42.93 v68.33,42.93 v53.59,42.93 v40.39,42.93 v26.42,42.93 v14.48,42.93 13.72,42.16 v3.05,42.16
3V3_FTDI
  Top 0.254: C4.1 36.35,23.65 36.83,24.13 45.19,24.13 U2.17
5V0  (via drill 0.36)
  Top 0.254: U2.20 43.29,22.21 43.18,22.1 43.18,21.06 C8.1
  Top 0.61: F1.2 40.35,21.15 C6.1 C7.1 43.13,21.01 C8.1 | v33.53,17.53 v33.53,22.86
  Top 0.813: F1.2 38.41,22.81 v38.35,22.86
  Bottom 0.61: P4X.4 14.26,16 32,16 v33.53,17.53 | v33.53,22.86 v38.35,22.86
!PWREN_FTDI  (via drill 0.36)
  Top 0.254: U4.39 71.37,21.59 v70.87,22.1 | v57.91,21.08 57.91,22.35 58.17,22.61 58.17,27.69 54.86,27.69 54.61,27.43 54.61,26.92 54.36,26.67 53.75,26.67 R1.1 | 53.73,26.42 R1.1 | U2.14 52.54,25.46 R1.1
  Bottom 0.254: v70.87,22.1 69.6,22.1 68.58,21.34 68.58,21.08 68.33,20.83 58.17,20.83 v57.91,21.08
!RST  (via drill 0.36)
  Top 0.254: v43.43,23.37 43.94,22.86 U2.19 46.74,22.86 v46.99,22.61 | v32.26,27.43 32.26,32.77 32,33.02 30.77,33.02 U1.3 | v83.06,20.07 83.09,20.09 U4.7 89.69,20.09 v90.42,20.83 | R9.1 93.92,5.39 C30.1 92.47,6.84 v92.46,6.86
  Bottom 0.254: 43.43,23.62 v43.43,23.37 43.43,27.18 43.18,27.43 v32.26,27.43 | v46.99,22.61 47.24,22.35 56.64,22.35 56.9,22.1 57.66,22.1 57.91,22.35 58.42,22.35 58.93,21.84 58.93,21.59 59.18,21.34 67.82,21.34 69.09,22.61 69.6,22.61 70.1,23.11 71.63,23.11 72.14,22.61 72.14,20.32 72.39,20.07 v83.06,20.07 | v90.42,20.83 90.68,20.83 90.68,7.62 91.44,6.86 v92.46,6.86
AUD_L
  Top 0.914: PJ2.2 52.94,58.88 PJ1.2 52.73,58.67 48.51,58.67 48.34,58.5 P1X.1
AUD_R
  Top 0.914: P2X.1 88.83,49.09 83.82,54.1 74.19,54.1 PJ2.3 62.44,54.08 PJ1.3
BOOT0
  Top 0.254: U4.60 80.75,13.07 R5.2 80.64,12.95 R8.1
BOOT1
  Top 0.254: U4.28 77.25,25.69 76.96,25.15 74.93,25.15 73.41,26.92 R4.2
CTS_BMD  (via drill 0.36)
  Top 0.254: U4.45 72.19,18.59 71.63,18.03 69.09,18.03 v69.09,18.29
  Bottom 0.254: v69.09,18.29 68.83,18.54 13.21,18.54 12.7,18.03 12.7,17.44 P4X.10
CTS_FTDI  (via drill 0.36)
  Top 0.254: v55.12,25.65 55.12,23.88 54.75,23.51 U2.11 | U4.15 83.09,24.09 v82.04,25.15
  Bottom 0.254: v55.12,25.65 55.63,25.15 57.15,25.15 57.91,25.65 81.53,25.65 v82.04,25.15
GND  (via drill 0.36)  (4 unrouted)
  Top 0.254: U4.12 86.35,22.59 v86.61,22.61 | J_ST.5 76.81,3.4 v76.96,3.3 | 71.93,16.32 71.88,16.28 C17.2 | C16.2 | 66.23,17.34 66.04,17.53 | U4.63 82.25,13.77 C24.2 | U4.47 71.95,17.59 71.88,17.53 71.88,17.27 | U4.31 75.75,27.68 C18.2 | C19.2 | C1.2 v23.88,26.42 | C2.2 24,23.75 v23.88,23.88 | U1.12 30.72,26.66 30.48,26.42 v29.21,26.42 | P1X.6 36.55,39.09 36.32,38.86 36.32,36.14 C5.2 | 84.11,28.39 C21.2 84.07,28.36 | R4.1 v69.85,28.19 | v64.93,28.45 64.93,30.23 | U4.18 82.25,27.64 82.3,27.69 83.82,27.69 84.07,27.94 84.07,28.61 | C31.1 94.05,22.42 94.23,22.61 | C32.1 94.05,15.06 v93.98,14.73
  Top 0.406: MUX2X.3 16,39.95 | P3X.3 97.17,50.66 v97.03,50.8 | C28.2 87.14,22.33 v86.61,22.61 | 64.84,29.3 64.93,28.7 | 40.45,19.81 C6.2 C7.2 43.13,19.85 C8.2 43.18,19.84 43.18,19.05 43.27,18.96 U2.25 47.91,18.96 48.01,19.05 | U2.18 47.87,23.51 48.01,23.37 48.01,21.59 | 48.01,19.05 v48.01,21.08 48.01,21.59 | U2.21 47.98,21.56 48.01,21.59 | 48.01,16 48.01,18.29 | 48.01,18.29 48.01,19.05 | U2.26 47.98,18.31 48.01,18.29 | C30.2 92.47,1 v92.71,0.76 | LED1.C v95.51,0.77 v95.5,0.76 | LED2.C v97.54,0.76 | LED3.C v99.57,0.76 | U2.7 53.93,20.91 v54.1,21.08 | 80.89,12.19 R5.1 | C22.2 85.33,29.95 v85.85,29.97 | 84.07,28.61 C21.2
  Top 0.61: C29.2 90.93,1.02 v91.19,0.76 | U5.2 88.14,1.02 v88.39,0.76 | C26.2 83.4,6.26 v82.8,6.86 | C12.2 64.84,29.3 | 36.33,20.15 C4.2 36.67,19.81 | 40.45,19.81 36.67,19.81 | C10.2 49.53,14.73 48.26,16 48.01,16 45.21,16 45.21,14.02 45.27,13.97 | C25.2 C24.2 | C3.2 35.09,19.6 35.31,19.81 36.67,19.81 | C25.2 82.52,9.68 v82.55,9.4 | C25.2 80.89,12.19 | v73.66,30.73 C20.2 75.18,29.57 C19.2 C18.2 | C21.2 C22.2 | C16.2 C17.2 | 71.88,16.28 71.88,17.27
  Top 0.813: C23.2 82.92,6.74 v82.8,6.86 | C16.2 65.21,16.07 64.9,16.38 | C27.2 91.19,25.15 91.44,24.89 91.44,22.86 v91.69,22.61 94.23,22.61 v95.5,22.61
  Top 0.914: 16,39.95 v16,47.75 | P2X.6 78.83,47.4 v78.74,47.5 | P2X.4 82.83,47.47 v82.8,47.5 | P1X.6 38.34,47.52 v38.1,47.75 | P1X.4 42.34,47.33 v41.91,47.75 | MUX1X.3 28.01,47.68 v27.94,47.75 | MUX3X.3 13.83,29.09 13.46,29.46 13.46,37.08 13.72,37.34 15.49,37.34 15.95,37.79 MUX2X.3 | MUX0X.3 102.98,30.59 v103.38,30.99 | 64.02,9.91 64.01,9.65 | C9.2 45.27,13.97 45.27,12.75 v45.21,12.7
  Top 1.422: C13.- 64.88,34.84 64.93,34.8
  Top 1.676: 64.01,11.94 64.01,15.13 U3.1
  Top 2.184: 64.01,9.65 55.28,9.65 PWR.GNDBREAK | 64.02,9.91 64.02,11.93 64.01,11.94 | U3.1 64.02,15.5 64.9,16.38 66.04,17.53
  Top 2.54: PWR.GNDBREAK 51.47,7.8 PWR.GND
  Top 3.048: C11.- C15.- | C14.- v64.93,28.45 64.93,28.7 64.93,30.23 v64.93,30.99 64.93,34.8 64.93,38.45 61.72,41.66 61.72,46.74 v62.74,47.75 | 66.04,17.53 66.04,21.08 65.02,22.1
  Bottom 0.254: v76.96,3.3 76.96,0.76 | v69.85,28.19 65.18,28.19 v64.93,28.45
  Bottom 0.406: 103.38,38.35 103.63,38.61 103.63,46.74 103.12,46.74 103.12,47.5 103.38,47.75 | v54.1,21.08 v48.01,21.08
  Bottom 0.61: v86.61,22.61 v91.69,22.61 | v82.55,9.4 82.55,7.11 v82.8,6.86 | v73.66,30.73 65.18,30.73 v64.93,30.99 | v85.85,29.97 102.36,29.97 v103.38,30.99 | v93.98,14.73 93.98,15.24 94.74,16
  Bottom 0.813: v82.8,6.86 82.8,1.02 82.55,0.76 | 15.68,1.34 16.26,0.76 | v23.88,26.42 0.76,26.42 | v23.88,23.88 v23.88,26.42 | v29.21,26.42 v23.88,26.42 | v95.5,22.61 103.12,22.61 103.38,22.35 | 94.74,16 94.74,16.26 95.5,17.02 103.12,17.02 103.38,17.27 | UART6.2 103.12,5.08 103.38,4.83 | UART6.1 103.38,2.54
  Bottom 0.914: 69.16,49.1 68.83,48.77 | 48.51,0.76 76.96,0.76 82.55,0.76 v88.39,0.76 v91.19,0.76 v92.71,0.76 v95.5,0.76 v97.54,0.76 v99.57,0.76 103.38,0.76 103.38,2.54 103.38,4.83 103.38,17.27 103.38,22.35 v103.38,30.99 103.38,38.35 | 48.51,0.76 45.21,0.76 | 45.21,0.76 16.26,0.76 0.76,0.76 0.76,26.42 0.76,62.99 1.02,63.25 57.4,63.25 | 57.4,63.25 69.09,63.25 | 57.44,62.38 57.44,62.01 57.4,61.98 57.4,63.25 | PJ2.1 69.16,63.17 69.09,63.25 | 69.09,63.25 102.62,63.25 103.38,62.48 103.38,47.75 103.38,42.16 | PWR.GND 48.47,0.8 48.51,0.76 | 45.21,0.76 v45.21,12.7 44.47,13.44 USB1X.4 | 80.01,47.5 80.77,47.5 81.28,48.01 80.52,48.01 80.01,47.5
  Bottom 1.676: P4X.3 15.68,1.34
  Bottom 1.778: 1.27,48.26 15.49,48.26 v16,47.75
  Bottom 2.794: v16,47.75 v27.94,47.75
  Bottom 3.048: v27.94,47.75 v38.1,47.75 v41.91,47.75 v58.42,47.75 v62.74,47.75 68.33,47.75 68.33,48.26 68.83,48.26 68.83,48.77 68.83,49.28 73.66,49.28 73.66,48.51 74.17,48.51 74.17,47.5 v78.74,47.5 80.01,47.5 v82.8,47.5 88.14,47.5 90.42,49.78 90.42,50.04 91.19,50.8 102.36,50.8
  pour Bottom (isolate 0.254, hatched): 0,0 0,64.26 104.14,64.26 104.14,0
  pour Top (isolate 0.254, hatched): 0,0 0,64.26 104.14,64.26 104.14,0
I2C1_SCL  (via drill 0.36)  (2 unrouted)
  Top 0.254: U1.22 39.06,32.97 v39.37,33.27 | R6.2 44.48,33.05 v44.7,33.27 | U4.61 v81.25,21.08 | v67.31,33.27 v67.31,23.62
  Bottom 0.254: v39.37,33.27 v44.7,33.27 v67.31,33.27 | v67.31,23.62 72.14,23.62 73.15,22.61 73.15,21.08 73.41,20.83 81,20.83 v81.25,21.08
I2C1_SDA  (via drill 0.36)
  Top 0.254: U4.62 81.75,20.28 82.55,21.08 v82.55,22.35 | U1.23 37.68,33.62 v38.35,34.29 | v43.69,34.04 42.72,34.04 R7.2 | v69.09,24.38 69.09,24.89 68.83,25.15 68.83,34.29 v68.58,34.54
  Bottom 0.254: v82.55,22.35 74.42,22.35 73.91,22.86 73.91,23.11 72.9,24.13 69.09,24.13 v69.09,24.38 | v38.35,34.29 43.43,34.29 v43.69,34.04 66.55,34.04 67.06,34.54 v68.58,34.54
I2C2_SCL  (via drill 0.36)
  Top 0.254: U4.29 76.75,29.25 77.22,29.72 v77.22,33.02 77.22,33.78 77.22,35.81 v77.47,36.07 | P2X.3 v84.83,36.07 v84.84,36.07 | v44.2,36.83 44.2,38.95 P1X.3 | R2.2 81.98,32.83 v81.79,33.02
  Bottom 0.254: v84.84,36.07 v77.47,36.07 44.45,36.07 v44.2,36.83 | v81.79,33.02 v77.22,33.02
I2C2_SDA  (via drill 0.36)
  Top 0.254: P1X.2 46.34,36.98 v46.48,36.83 | v86.87,36.83 86.87,39.06 P2X.2 | R3.2 78.25,13.4 U4.55 78.25,16.49 v77.98,16.76 | v68.58,17.27 68.33,17.27 68.33,17.78 68.07,18.03 68.07,22.86 68.33,23.11 68.33,23.88 68.07,24.38 68.07,33.78 67.31,34.54 v67.31,36.83
  Bottom 0.254: v46.48,36.83 v67.31,36.83 67.56,36.83 67.82,37.08 86.61,37.08 v86.87,36.83 | v77.98,16.76 69.09,16.76 v68.58,17.27
LED1
  Top 0.406: LED1.A 95.51,4.47 R11.2
LED2
  Top 0.406: LED2.A R12.2
LED3
  Top 0.406: LED3.A R13.2
LED_B
  Top 0.254: U4.4 87.07,18.59 87.63,18.03 87.63,10.67 87.88,10.41 98.04,10.41 99.57,8.89 R13.1
LED_G
  Top 0.254: U4.3 86.55,18.09 86.87,17.78 86.87,9.91 87.12,9.65 96.77,9.65 97.54,8.89 R12.1
LED_R
  Top 0.254: U4.2 86.04,17.59 86.11,17.53 86.11,9.65 86.87,8.89 95,8.89 95.5,8.38 95.5,5.64 R11.1
N$7
  Top 0.61: U5.4 90.65,6.13 90.93,5.84 C29.1
OSC_IN
  Top 0.254: Y1.1 98.37,15.68 98.3,15.75 98.3,17.02 92.71,17.02 91.69,17.02 90.89,19.09 U4.5
  Top 0.406: C32.2 92.89,16.84 92.71,17.02
OSC_OUT
  Top 0.254: U4.6 90.71,19.59 91.95,20.57 92.71,20.57 | 92.71,20.57 94.68,20.57 Y1.3 | C31.2 92.89,20.9 92.71,20.57
PUP
  Top 0.254: R10.1 33.02,34.54 32.77,34.29 | 32.77,34.29 30.75,34.29 U1.1 U1.2 | U1.21 32.96,32.32 32.77,32.51 32.77,34.29
PWM_B
  Top 0.254: P3X.7 100.17,37.18 99.31,36.32 89.41,36.32 87.63,34.54 86.36,34.54 85.85,34.04 81.28,34.04 80.77,33.53 80.77,26.54 U4.21
PWM_G
  Top 0.254: P3X.6 99.42,37.19 99.06,36.83 89.15,36.83 87.38,35.05 86.11,35.05 85.6,34.54 80.77,34.54 80.26,34.04 80.26,26.53 U4.22
PWM_R
  Top 0.254: P3X.5 98.67,37.96 98.04,37.34 88.9,37.34 87.12,35.56 85.85,35.56 85.34,35.05 80.26,35.05 79.76,34.54 U4.23
RTS_BMD  (via drill 0.36)
  Top 0.254: U4.44 70.4,19.09 v70.36,19.05
  Bottom 0.254: v70.36,19.05 9.65,19.05 9.65,17.44 P4X.11
RTS_FTDI  (via drill 0.36)
  Top 0.254: U2.3 56.92,18.31 57.15,18.54 v57.15,24.13 | U4.14 81.82,23.59 v80.77,24.64
  Bottom 0.254: v57.15,24.13 58.17,25.15 80.26,25.15 v80.77,24.64
RXD_BMD  (via drill 0.36)
  Top 0.254: P4X.8 v18.68,20.46 | v69.85,21.08 71.37,21.08 72.11,20.09 U4.42
  Bottom 0.254: v18.68,20.46 19.05,20.07 69.09,20.07 v69.85,21.08
RXD_FTDI  (via drill 0.36)
  Top 0.254: U4.16 83.36,24.59 v83.31,25.15 | v56.39,25.91 56.39,19.81 56.19,19.61 U2.5
  Bottom 0.254: v56.39,25.91 57.15,25.91 57.4,26.16 82.8,26.16 83.31,25.65 v83.31,25.15
RXD_UART6  (via drill 0.36)
  Top 0.254: UART6.5 v89.41,12.7 | v78.74,18.03 75.69,18.03 74.68,19.05 74.68,21.84 74.43,22.09 U4.38
  Bottom 0.254: v89.41,12.7 79.5,12.7 79.5,17.27 v78.74,18.03
SC0  (via drill 0.36)
  Top 0.254: U1.5 28.79,31.67 v28.45,32 | v90.42,31.75 90.42,29.72 90.93,29.21 92.62,29.21 MUX0X.2
  Bottom 0.254: v90.42,31.75 28.7,31.75 v28.45,32
SC1
  Top 0.254: U1.7 26.78,30.37 26.67,30.48 26.67,37.08 27.18,37.59 29.21,37.59 29.46,37.85 29.46,39.9 MUX1X.2
SC2
  Top 0.254: U1.9 26.05,29.07 25.65,29.46 25.65,35.81 25.15,36.32 18.03,36.32 17.27,37.08 17.27,39.77 MUX2X.2
SC3
  Top 0.254: U1.11 24.81,27.77 24.38,28.19 24.38,30.23 24.13,30.48 22.04,30.48 MUX3X.2
SC4  (via drill 0.36)
  Top 0.254: v91.19,39.62 91.19,38.35 91.69,37.85 96.27,37.85 96.42,38 P3X.2 | U1.14 47.83,27.77 49.02,28.96 49.02,35.81 49.53,36.32 49.53,40.13 v50.04,40.64
  Bottom 0.254: v91.19,39.62 50.04,39.62 v50.04,40.64
SC5  (via drill 0.36)
  Top 0.254: U1.16 35.2,29.07 35.05,29.21 v33.53,29.21 | v5.08,29.21 4.57,28.7 4.57,16.52 P4X.6
  Bottom 0.254: v33.53,29.21 v5.08,29.21
SD0  (via drill 0.36)
  Top 0.254: v89.15,32.77 89.15,28.96 90.42,27.69 92.64,27.69 MUX0X.1 | U1.4 29.66,32.32 v28.45,33.53
  Bottom 0.254: v89.15,32.77 88.65,32.26 29.72,32.26 v28.45,33.53
SD1
  Top 0.254: MUX1X.1 31.01,37.36 30.73,37.08 27.43,37.08 27.18,36.83 27.18,31.24 27.43,30.99 27.46,31.02 U1.6
SD2
  Top 0.254: MUX2X.1 18.95,36.94 19.05,36.83 25.65,36.83 26.16,36.32 26.16,29.97 26.42,29.72 U1.8
SD3
  Top 0.254: MUX3X.1 24.55,32.09 24.89,31.75 24.89,28.96 25.43,28.42 U1.10
SD4  (via drill 0.36)
  Top 0.254: P3X.1 94.78,39.58 v94.74,39.62 | U1.13 48.2,27.12 49.53,28.45 49.53,35.56 50.55,36.58 v50.55,37.85
  Bottom 0.254: v94.74,39.62 94.74,39.37 94.23,38.86 50.55,38.86 v50.55,37.85
SD5  (via drill 0.36)
  Top 0.254: U1.15 35.27,28.42 v34.8,28.19 | v5.33,28.19 5.33,18.76 P4X.12
  Bottom 0.254: v34.8,28.19 v5.33,28.19
SWCLK_ST
  Top 0.254: U4.49 75.25,6.49 J_ST.4
SWDIO_ST
  Top 0.254: J_ST.2 74.27,15.85 74.68,16.26 74.68,17.78 74.36,18.09 U4.46
TXD_BMD  (via drill 0.36)
  Top 0.254: U4.43 71.34,19.59 v70.87,20.32 | v15.75,20.07 15.75,17.49 P4X.9
  Bottom 0.254: v70.87,20.32 69.85,20.07 69.34,19.56 15.75,19.56 v15.75,20.07
TXD_FTDI  (via drill 0.36)
  Top 0.254: U4.17 83.66,26.51 v83.82,26.67 | v49.02,26.67 v49.02,17.02 | v54.1,17.02 U2.1
  Bottom 0.254: v83.82,26.67 v49.02,26.67 | v49.02,17.02 v54.1,17.02
TXD_UART6  (via drill 0.36)
  Top 0.254: U4.37 74.94,22.59 75.18,22.35 75.18,19.81 75.69,19.3 79.5,19.3 v80.26,18.54 | v88.65,14.48 88.65,13.72 88.14,13.21 88.14,11.68 88.65,11.18 100.58,11.18 UART6.4
  Bottom 0.254: v80.26,18.54 80.26,14.22 80.77,13.72 87.88,13.72 v88.65,14.48
USB_DM
  Top 0.254: U2.16 26.67,24.81 | 26.67,24.81 22.02,24.81 21.59,24.38 21.59,17.51 P4X.7 | C2.1 26.49,24.63 26.67,24.81
  Top 0.406: USB1X.2 23.66,15.44 P4X.7
USB_DP
  Top 0.254: U2.15 26.67,25.46 | 26.67,25.46 20.38,25.46 20.32,25.4 20.32,15.78 P4X.1 | C1.1 26.49,25.64 26.67,25.46
  Top 0.406: USB1X.3 22.66,13.44 P4X.1
VBUS_IN
  Top 0.61: F1.1 35.17,18.15 C3.1
  Top 1.676: F1.1 38.41,17.2 USB1X.1
VCAP
  Top 0.254: U4.30 76.25,30.64 C20.1
VDD  (via drill 0.36)  (1 unrouted)
  Top 0.254: 89.81,23.26 L1.2 | J_ST.1 74.27,2.13 74.68,2.03 | U4.48 73.33,16.69 | U4.32 74.58,26.51 74.17,26.92 74.17,28.1 | R10.2 34.04,34.54 34.29,34.29 36.34,34.29 U1.24 36.38,34.29 37.08,34.29 37.41,34.62 C5.1 | U4.19 81.75,28.16 | 82.95,28.39 C21.1 | U4.1 84.67,16.85 84.58,16.76 | U4.64 82.99,15.17 83.06,15.24
  Top 0.406: U2.4 50.89,18.96 50.8,19.05 | C10.1 51.31,14.8 51.31,15.24 50.8,15.75 50.8,19.05 | C16.1 70.28,14.91 | C17.1 | v41.2,35.51 39.68,35.51 39.62,35.56 | v50.8,35.05 50.8,27.69 | 50.8,27.69 50.8,19.05 | R1.2 50.94,27.55 50.8,27.69 | R9.2 v93.98,2.79 | v87.19,7.37 87.19,7.81 86.87,8.13 | 82.93,29.97 C22.1
  Top 0.61: U5.5 v87.19,7.37 87.19,8.06 87.12,8.13 86.87,8.13 85.51,8.13 C26.1 | C5.1 39.62,35.56 41.15,35.56 v41.2,35.51 R7.1 | R6.1 R7.1 | R7.1 | 84.07,8.13 83.68,8.52 C25.1 C24.1 83.72,13.46 84.33,13.46 84.58,13.72 84.58,15.24 | R3.1 77.91,11.94 R8.2 79.25,8.38 79.5,8.13 81.03,8.13 | 84.58,16.76 v84.58,15.49 84.58,15.24 | 83.06,15.24 84.58,15.24 | C28.1 89.56,21.74 88.9,21.08 v88.14,21.08 | 81.75,28.16 81.75,28.67 v81.53,28.7 81.59,28.65 C21.1 C22.1 82.99,30 R2.1 | C19.1 C18.1 74.08,28.19 72.9,28.19 72.39,28.7 v72.14,28.7
  Top 0.813: 85.51,8.13 84.07,8.13 81.03,8.13 81.03,2.29 80.77,2.03 74.68,2.03 v69.09,2.03 v69.09,14.99 69.17,14.91 70.28,14.91 | 51.31,14.8 54.17,14.8 v54.36,14.99 | 73.33,16.69 73.33,15.17 73.15,14.99 71.75,14.99 C17.1 | C17.1 C16.1 | 89.81,23.26 89.81,22.59 C28.1
  Bottom 0.406: v50.8,35.05 43.43,35.05 42.93,35.56 41.26,35.56 v41.2,35.51 | v93.98,2.79 87.12,2.79 87.12,7.3 v87.19,7.37
  Bottom 0.61: v88.14,21.08 84.58,21.08 | 84.58,21.08 v84.58,15.49 | 84.58,21.08 84.58,25.4 85.09,25.65 85.09,28.7 v81.53,28.7 v72.14,28.7
  Bottom 0.813: v54.36,14.99 v69.09,14.99
VDDA
  Top 0.254: U4.13 85.83,23.09 86.36,23.62 L1.1
  Top 0.406: 88.32,23.55 L1.1
  Top 0.61: C27.1 88.32,23.55
VIN_DC  (via drill 0.36)
  Top 0.61: U5.3 89.09,4.64 88.9,4.83 87.38,4.83 87.19,4.38 U5.1 87.12,3.59 C23.1
  Top 0.813: C23.1 82.92,0.88 82.8,0.76 67.82,0.76 v67.82,12.45
  Top 0.914: C9.1 47.93,14.55 48.51,13.97 48.51,10.84 PWR.PWR
  Top 1.676: U3.3 58.94,12.96 58.93,12.95 | PWR.PWR 45.55,7.87 22.86,7.87 18.68,12.05 P4X.2
  Top 2.184: 58.93,12.95 58.93,12.45 v56.39,12.45 50.12,12.45 PWR.PWR
  Bottom 0.813: v67.82,12.45 v56.39,12.45

### Text on the board
tPlace: PCBA : 07_17_2017 | NSVR Control Board | 8.0 mHz
tNames: NSVR | Hardlight 1
bNames: NSVR | Hardlight 1